# EAGLE design dummyLoad (EAGLE 7.5.0)
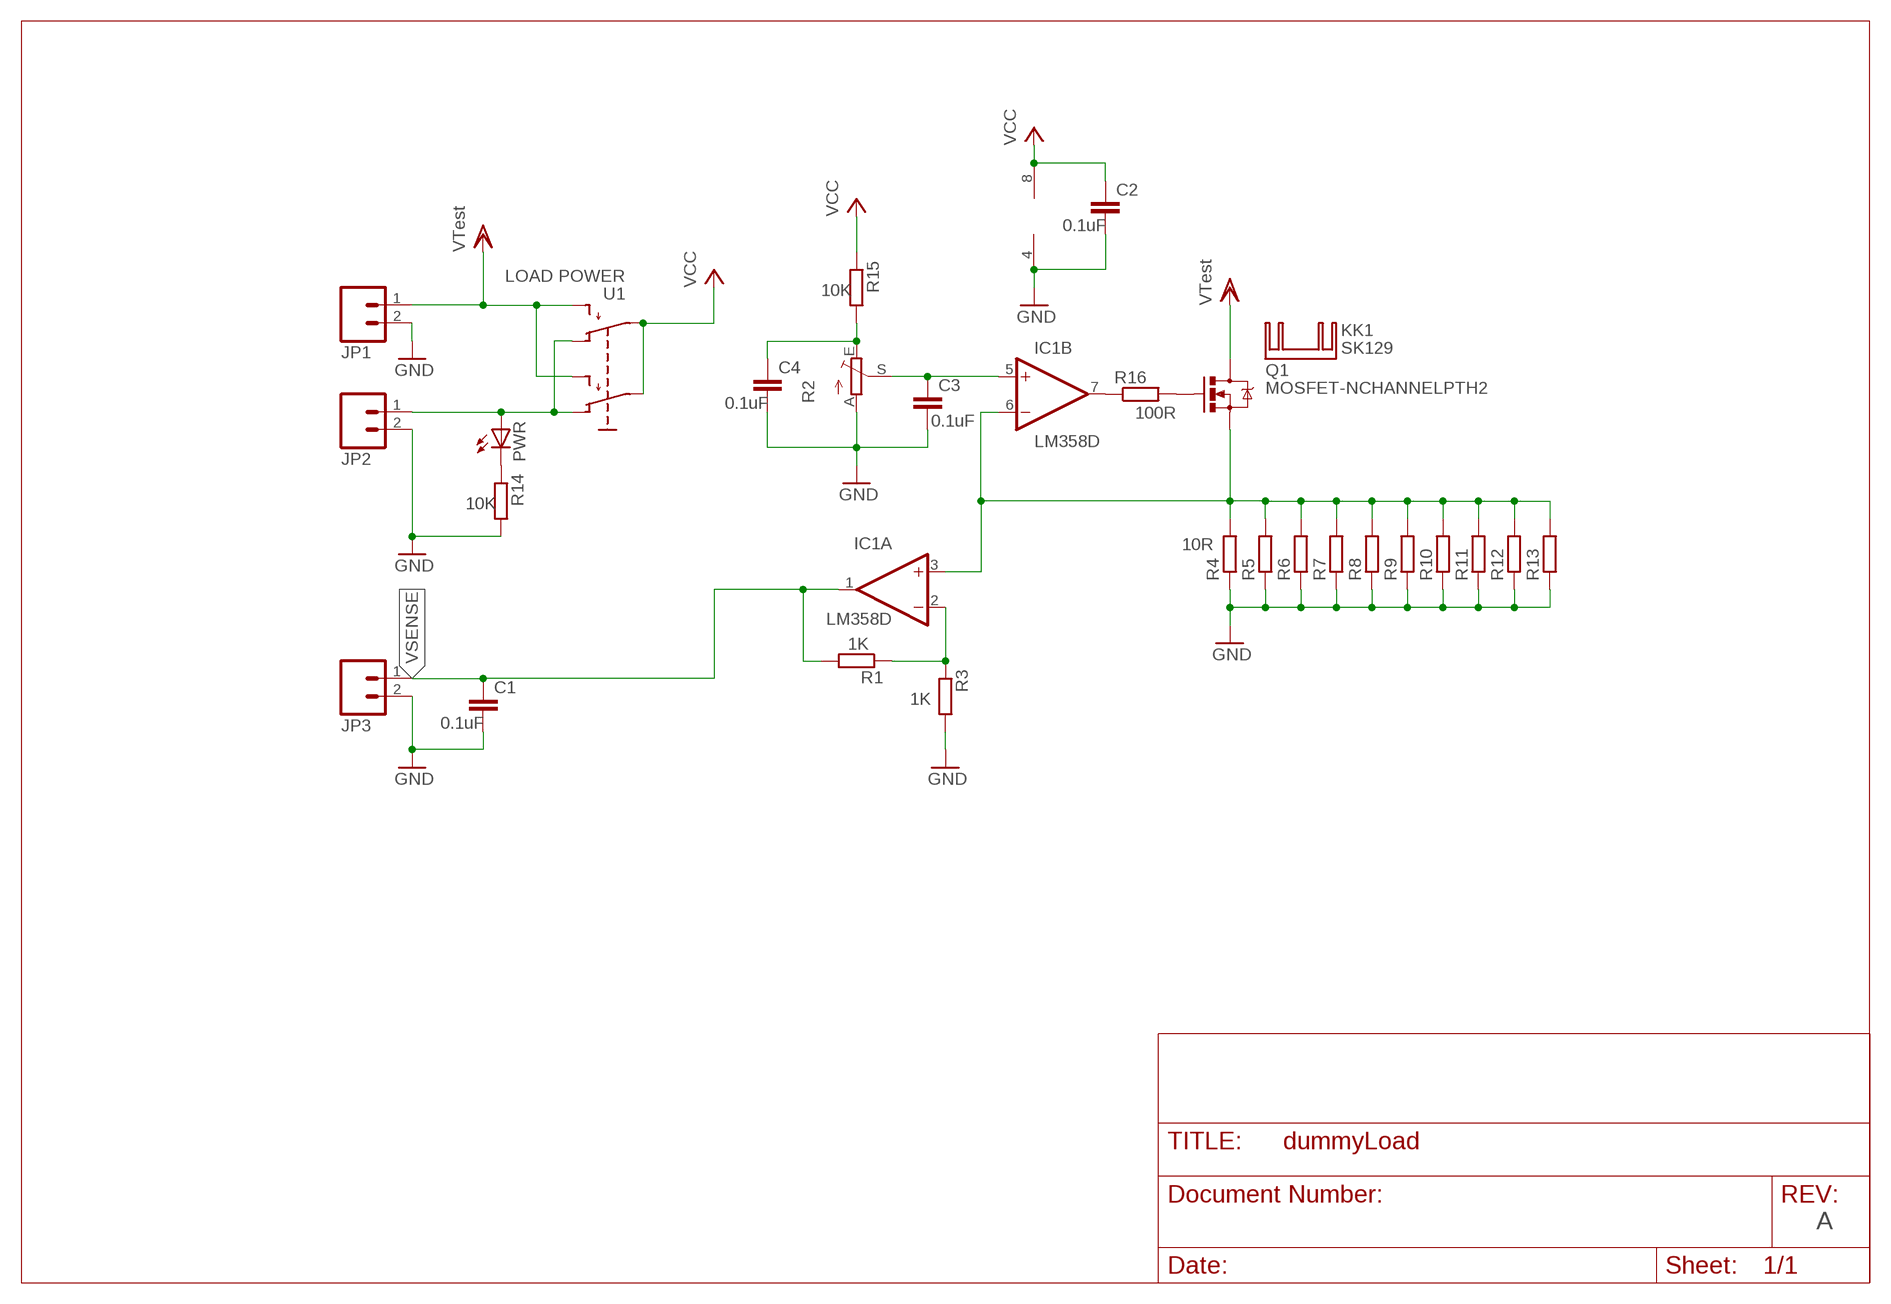
[diagram p0: schematic, sheet 1]

## Parts
C1  0.1uF  C-EUC0805  [C0805]
C2  0.1uF  C-EUC0805  [C0805]
C3  0.1uF  C-EUC0805  [C0805]
C4  0.1uF  C-EUC0805  [C0805]
IC1  LM358D  [SO08]
JP1  M02PTH  [1X02]
JP2  M02PTH  [1X02]
JP3  M02PTH  [1X02]
KK1  SK129  [SK129-HOLE]
PWR  LEDCHIPLED_0805  [CHIPLED_0805]
Q1  MOSFET-NCHANNELPTH2  [TO220V]
R1  1K  R-EU_M0805  [M0805]
R2  TRIM_EU-B64Y  [B64Y]
R3  1K  R-EU_M0805  [M0805]
R4  10R  R-EU_M0805  [M0805]
R5  R-EU_M0805  [M0805]
R6  R-EU_M0805  [M0805]
R7  R-EU_M0805  [M0805]
R8  R-EU_M0805  [M0805]
R9  R-EU_M0805  [M0805]
R10  R-EU_M0805  [M0805]
R11  R-EU_M0805  [M0805]
R12  R-EU_M0805  [M0805]
R13  R-EU_M0805  [M0805]
R14  10K  R-EU_M0805  [M0805]
R15  10K  R-EU_M0805  [M0805]
R16  100R  R-EU_M0805  [M0805]
U1  LOAD POWER  MINI_SWITCH  [SWITCH-JS202011]

## Nets
GND: C1.2 C2.2 C3.2 C4.2 IC1.4(P:V-) JP1.2 JP2.2 JP3.2 R2.A R3.2 R4.1 R5.1 R6.1 R7.1 R8.1 R9.1 R10.1 R11.1 R12.1 R13.1 R14.2
N$1: JP2.1 PWR.A U1.P1(O) U1.P4(O1)
N$2: IC1.2(A:-IN) R1.1 R3.1
N$3: C4.1 R2.E R15.2
N$4: IC1.7(B:OUT) R16.1
N$5: C3.1 IC1.5(B:+IN) R2.S
N$6: PWR.C R14.1
N$7: Q1.1(G) R16.2
N$19: IC1.3(A:+IN) IC1.6(B:-IN) Q1.3(S) R4.2 R5.2 R6.2 R7.2 R8.2 R9.2 R10.2 R11.2 R12.2 R13.2
VCC: C2.1 IC1.8(P:V+) R15.1 U1.P2(P) U1.P5(P1)
VDD: JP1.1 Q1.2(D) U1.P3(S) U1.P6(S1) ; supply symbol labelled VTest
VSENSE: C1.1 IC1.1(A:OUT) JP3.1 R1.2

## Notes on the sheet
- A

## Library data of the parts
C1-C4 = rcl:C-EU: CAPACITOR, European symbol
IC1 = linear:LM358: OP AMP also LM158; LM258; LM2904 Source: http://cache.national.com/ds/LM/LM158.pdf
JP1-JP3 = SparkFun:M02: Header 2 Standard 2-pin 0.1" header. Use with straight break away headers (SKU : PRT-00116), right angle break away headers (PRT-00553), swiss pins (PRT-00743), machine pins (PRT-00117), and female headers (PRT-00115). Molex polarized connector foot print use with SKU : PRT-08233 with associated crimp pins and housings.
KK1 = heatsink:SK129: HEATSINK manufacturer Fischer/distributor Buerklin
PWR = led:LED: LED OSRAM: - CHIPLED LG R971, LG N971, LY N971, LG Q971, LY Q971, LO R971, LY R971 LH N974, LH R974 LS Q976, LO Q976, LY Q976 LO Q996 - Hyper CHIPLED LW Q18S LB Q993, LB Q99A, LB R99A - SideLED LS A670, LO A670, LY A670, LG A670, LP A670 LB A673, LV A673, LT A673, LW A673 LH A674 LY A675 LS A676, LA A676, LO A676, LY A676, LW A676 LS A679, LY A679, LG A679 - Hyper Micro SIDELED® LS Y876, LA Y876, LO Y876, LY Y876 LT Y87S - SmartLED LW L88C, LW L88S LB L89C, LB L89S, LG L890 LS L89K, LO L89K, LY L89K LS L896, LA L896, LO L896, LY L896 - TOPLED LS T670, LO T670, LY T670, LG T670, LP T670 LSG T670, LSP T670, LSY T670, LOP T670, LYG T670 LG T671, LOG T671, LSG T671 LB T673, LV T673, LT T673, LW T673 LH T674 LS T676, LA T676, LO T676, LY T676, LB T676, LH T676, LSB T676, LW T676 LB T67C, LV T67C, LT T67C, LS T67K, LO T67K, LY T67K, LW E67C LS E67B, LA E67B, LO E67B, LY E67B, LB E67C, LV E67C, LT E67C LW T67C LS T679, LY T679, LG T679 LS T770, LO T770, LY T770, LG T770, LP T770 LB T773, LV T773, LT T773, LW T773 LH T774 LS E675, LA E675, LY E675, LS T675 LS T776, LA T776, LO T776, LY T776, LB T776 LHGB T686 LT T68C, LB T68C - Hyper Mini TOPLED® LB M676 - Mini TOPLED Santana® LG M470 LS M47K, LO M47K, LY M47K Source: http://www.osram.convergy.de LUXEON: - LUMILED® LXK2-PW12-R00, LXK2-PW12-S00, LXK2-PW14-U00, LXK2-PW14-V00 LXK2-PM12-R00, LXK2-PM12-S00, LXK2-PM14-U00 LXK2-PE12-Q00, LXK2-PE12-R00, LXK2-PE12-S00, LXK2-PE14-T00, LXK2-PE14-U00 LXK2-PB12-K00, LXK2-PB12-L00, LXK2-PB12-M00, LXK2-PB14-N00, LXK2-PB14-P00, LXK2-PB14-Q00 LXK2-PR12-L00, LXK2-PR12-M00, LXK2-PR14-Q00, LXK2-PR14-R00 LXK2-PD12-Q00, LXK2-PD12-R00, LXK2-PD12-S00 LXK2-PH12-R00, LXK2-PH12-S00 LXK2-PL12-P00, LXK2-PL12-Q00, LXK2-PL12-R00 Source: www.luxeon.com KINGBRIGHT: KA-3528ASYC Source: www.kingbright.com
Q1 = SparkFun:MOSFET-NCHANNEL
R1 R3-R16 = resistor:R-EU_: RESISTOR, European symbol
R2 = pot:TRIM_EU-: POTENTIOMETER
U1 = fmc:MINI_SWITCH

## Board
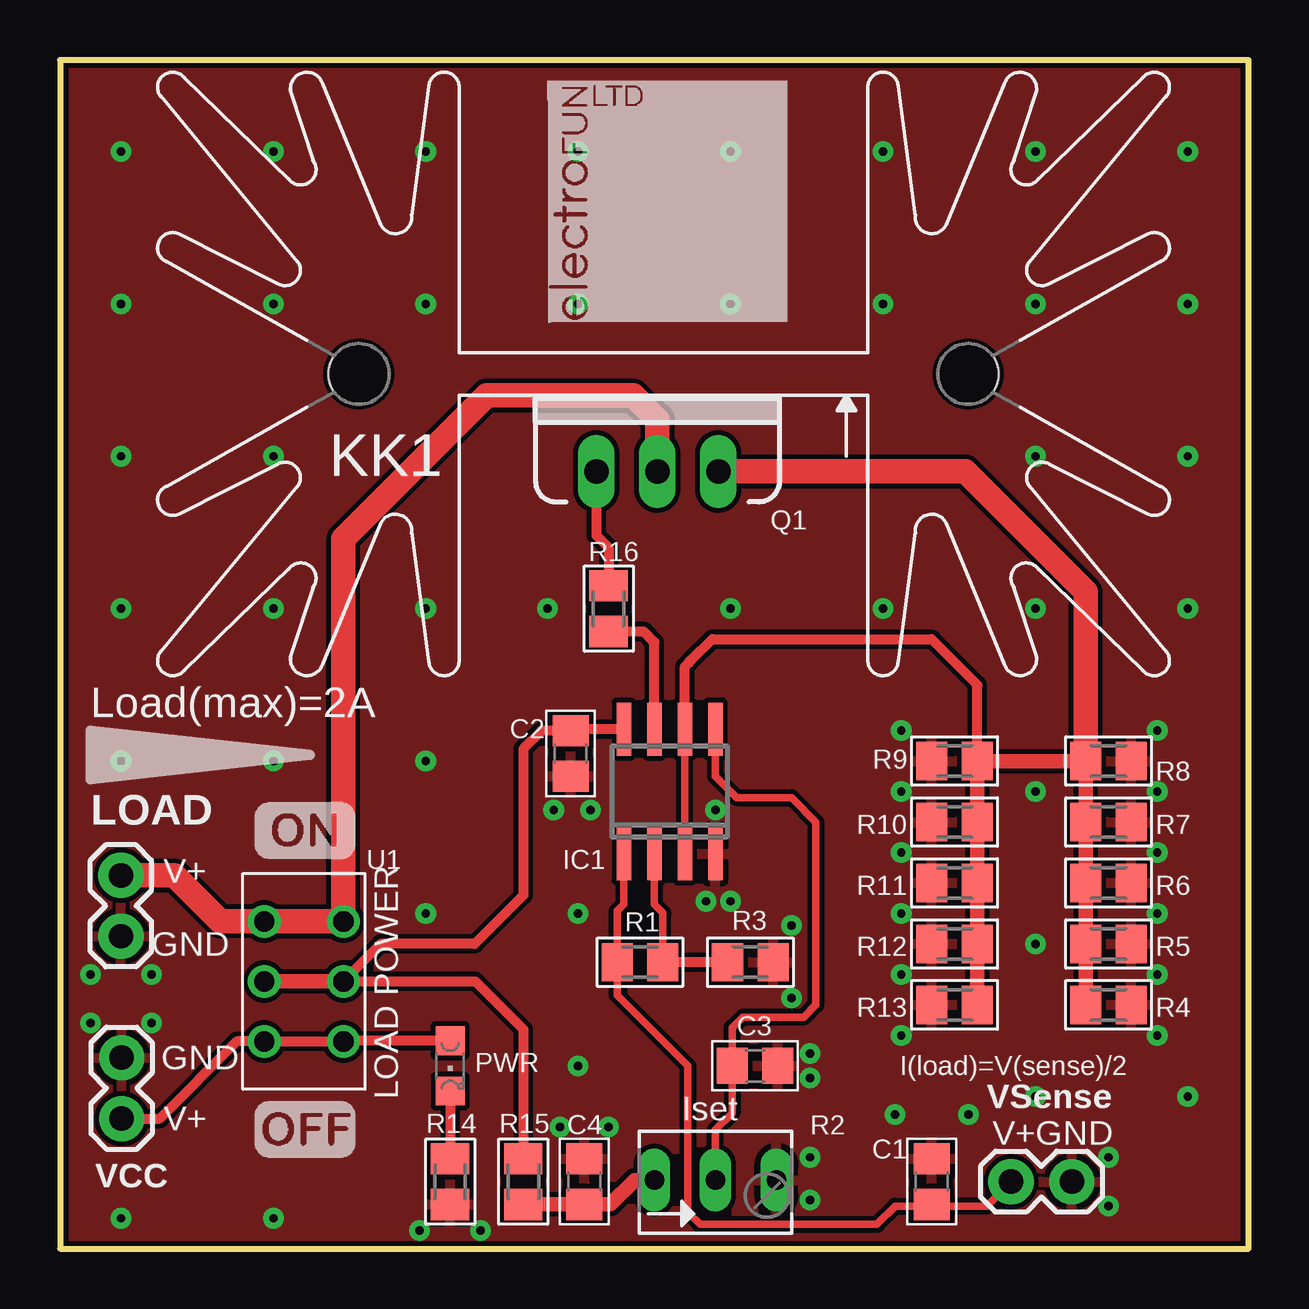
[diagram p1: board, top side]
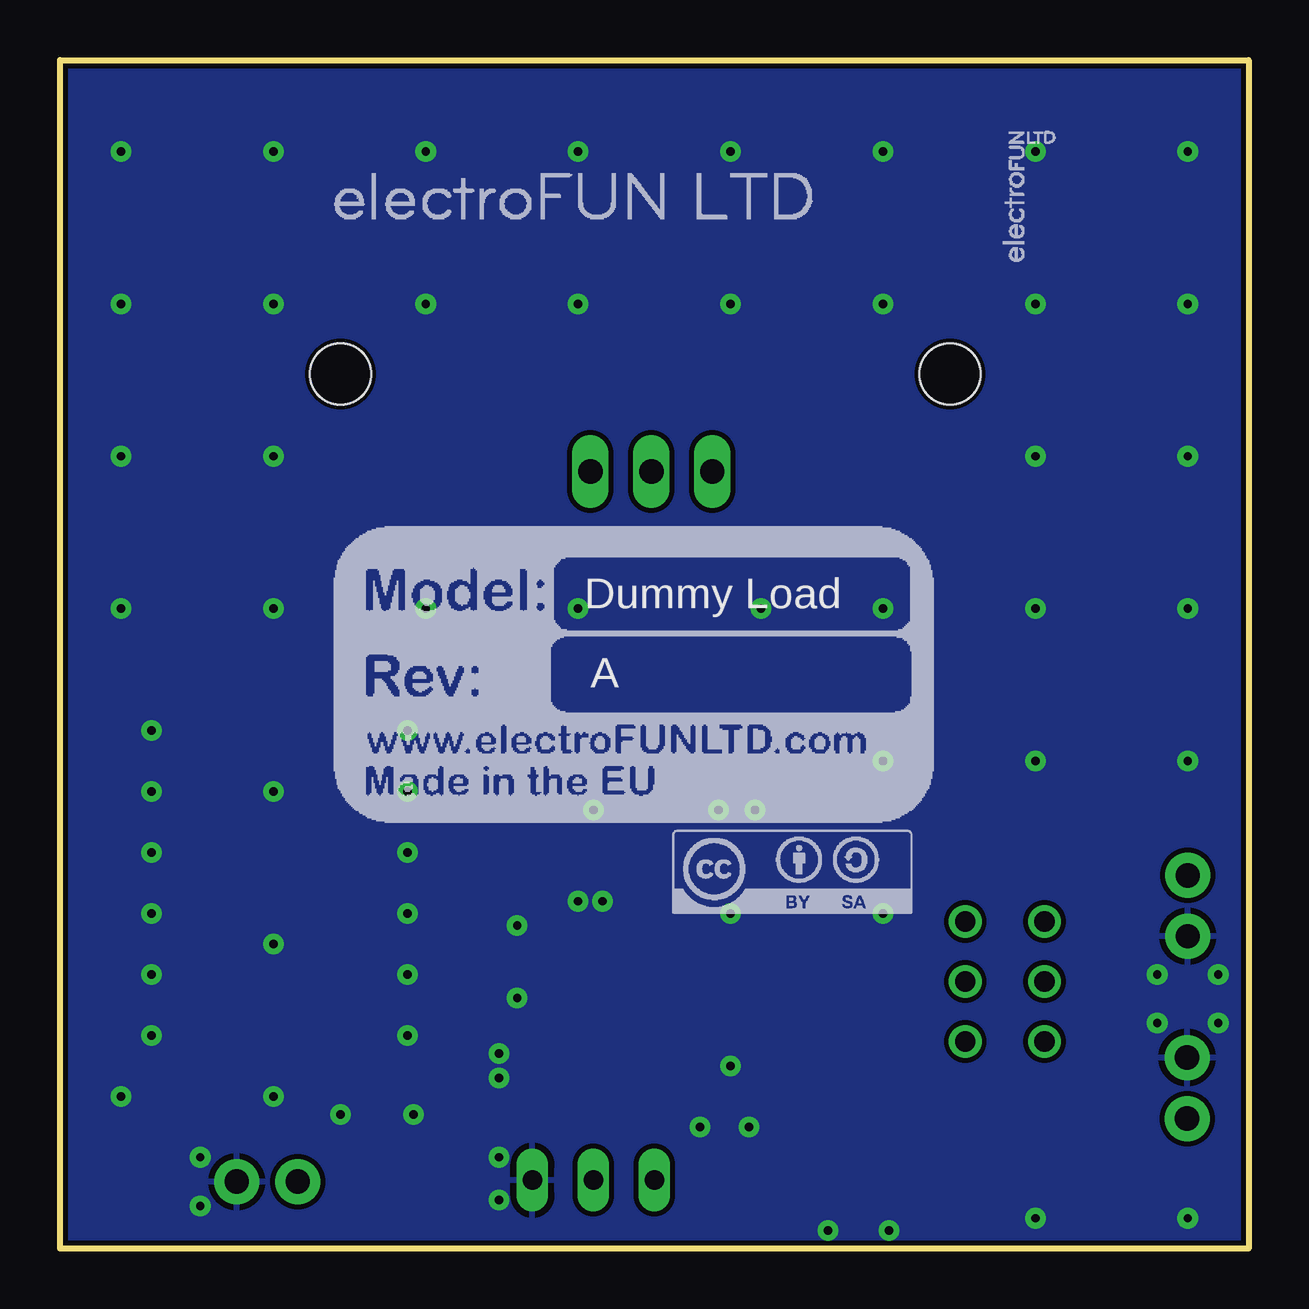
[diagram p2: board, bottom side, seen from below]

Size 49.53 x 49.53 mm. Coordinates in mm from the lower left corner, seen from the top.
Outline: 0,0 49.53,0 49.53,49.53 0,49.53 0,0
Copper layers (1*16): Top 0.035mm / dielectric 1.5mm / Bottom 0.035mm
Design rules "SparkFun-2-layer *": minimum track width 7mil, minimum drill 0.3mm, track to track 8mil, track to pad 8mil, pad to pad 8mil, via to via 8mil, smd to smd 8mil, copper to edge 8mil, drill to drill 8mil, minimum pad ring 10mil, minimum via ring 10mil, stop-mask expansion 4mil, vias tented up to drill 20mil, thermal gap 10mil

### Footprints (pad centres in the part's own frame; a part is rotated, then mirrored left to right if it is on the bottom)
C0805 = smd 1.3 x 1.5: 1 -0.95,0; 2 0.95,0
SO08 = smd 0.6 x 2.2: 1 -1.905,-2.6; 2 -0.635,-2.6; 3 0.635,-2.6; 4 1.905,-2.6; 5 1.905,2.6; 6 0.635,2.6; 7 -0.635,2.6; 8 -1.905,2.6
1X02 = drill 1.016 pad 1.88: 1 0,0; 2 2.54,0
SK129-HOLE = hole 2.54: -12.7,-0.889; 12.7,-0.889
CHIPLED_0805 = smd 1.2 x 1.2: A 0,-1.05; C 0,1.05
TO220V = drill 1.016 long: 1 -2.54,0; 2 0,0; 3 2.54,0
M0805 = smd 1.3 x 1.6: 1 -0.95,0; 2 0.95,0
B64Y = drill 0.813 long: A 2.54,0; E -2.54,0; S 0,0
SWITCH-JS202011 = drill 0.85: P1 0,-1.65; P2 2.5,-1.65; P3 5,-1.65; P4 0,1.65; P5 2.5,1.65; P6 5,1.65

### Placement (x,y rotation side)
C1  36.32,2.79 90 top
C2  21.27,20.64 270 top
C3  28.96,7.62 0 top
C4  21.84,2.79 90 top
IC1  25.4,19.05 0 top
JP1  2.54,15.56 270 top
JP2  2.57,5.42 90 top
JP3  39.62,2.79 0 top
KK1  25.15,35.56 180 top
PWR  16.26,7.62 180 top
Q1  24.89,32.38 0 top
R1  24.17,11.94 180 top
R2  27.3,2.86 0 top
R3  28.77,11.94 0 top
R4  43.69,10.16 180 top
R5  43.69,12.7 180 top
R6  43.69,15.24 180 top
R7  43.69,17.78 180 top
R8  43.69,20.32 180 top
R9  37.27,20.32 0 top
R10  37.27,17.78 0 top
R11  37.27,15.24 0 top
R12  37.27,12.7 0 top
R13  37.27,10.16 0 top
R14  16.26,2.79 270 top
R15  19.3,2.79 270 top
R16  22.86,26.67 90 top
U1  10.16,8.64 90 top
U$1  [ELECTROFUN_10X10]  20.32,38.61 0 top
U$2  [ON]  8.13,16.26 0 top
U$3  [ELECTROFUN_STRIP]  43.5,40.64 0 bottom
U$4  [SA-BY]  24,13.97 0 bottom
U$5  [OFF]  8.13,3.81 0 top
U$6  [BOARD_REF]  38.1,17.78 0 bottom

### Tracks (layer width: path | path; a pad name or v marks a point on that pad's centre or on a via)
GND  (via drill 0.35)
  other vias: 22.1,18.29 20.57,18.29 26.92,14.48 27.94,14.48 30.48,13.46 30.48,10.44 31.24,8.13 31.24,7.11 22.86,5.08 20.83,5.08 35.05,21.59 35.05,19.05 35.05,16.51 35.05,13.97 35.05,11.43 35.05,8.89 45.72,21.59 45.72,19.05 45.72,16.51 45.72,13.97 45.72,11.43 45.72,8.89 37.85,5.59 34.8,5.59 43.69,3.81 43.69,1.78 31.24,2.03 31.24,3.81 27.3,18.29 2.54,45.72 8.89,45.72 8.89,39.37 2.54,39.37 2.54,33.02 8.89,33.02 2.54,26.67 8.89,26.67 8.89,20.32 2.54,20.32 1.27,11.43 3.81,11.43 1.27,9.4 3.81,9.4 15.24,45.72 15.24,39.37 21.59,45.72 21.59,39.37 27.94,39.37 27.94,45.72 34.29,39.37 34.29,45.72 40.64,45.72 40.64,39.37 46.99,39.37 46.99,45.72 46.99,33.02 40.64,33.02 40.64,26.67 34.29,26.67 27.94,26.67 46.99,26.67 40.64,19.05 40.64,12.7 40.64,6.35 46.99,6.35 15.24,20.32 15.24,26.67 20.32,26.67 15.24,13.97 21.59,13.97 21.59,7.62 8.89,1.27 2.54,1.27 14.99,0.76 17.53,0.76
  pour Top (rank 3): 0,0 0,49.53 49.53,49.53 49.53,0
  pour Bottom: 49.85,49.85 49.85,0.32 6.35,0 0,0 0,49.85
N$1
  Top 0.406: U1.P1 U1.P4 7.37,8.64 4.15,5.42 JP2.1 | PWR.A 11.84,8.67
  Top 0.61: 11.84,8.67 U1.P1
N$2
  Top 0.305: IC1.2 24.77,14.35 25.12,14 R1.1
  Top 0.406: R3.1 R1.1
N$3
  Top 0.61: R15.2 C4.1 22.93,1.84 23.94,2.86 R2.E
N$4
  Top 0.406: R16.1 24.32,25.72 24.77,25.27 IC1.7
N$5
  Top 0.305: R2.S 27.3,4.95 28.01,5.65 C3.1 28.01,9.21 28.45,9.65 30.99,9.65 31.5,10.16 31.5,17.78 30.48,18.8 28.19,18.8 27.3,19.68 IC1.5
N$6
  Top 0.406: PWR.C R14.1
N$7
  Top 0.406: Q1.1 22.35,29.72 22.86,29.21 R16.2
N$19
  Top 0.305: IC1.3 IC1.6
  Top 0.406: R9.2 38.22,23.5 36.32,25.4 27.18,25.4 26.29,24.51 26.16,24.38 26.04,24.26 IC1.6
  Top 0.61: R4.2 R5.2 R6.2 R7.2 R8.2 R9.2 R10.2 R11.2 R12.2 R13.2
  Top 1.016: Q1.3 37.72,32.38 42.74,27.37 R8.2
VCC
  Top 0.406: R15.1 19.3,9.14 17.31,11.14 U1.P2 13.37,12.7 17.27,12.7 19.3,14.73 19.3,20.83 20.07,21.59 C2.1 21.34,21.65 IC1.8
  Top 0.61: U1.P5 U1.P2
VDD
  Top 1.016: JP1.1 4.76,15.56 6.68,13.64 U1.P6 U1.P3 11.81,29.59 17.78,35.56 23.88,35.56 24.89,34.54 Q1.2
VSENSE
  Top 0.305: IC1.1 23.5,14.35 23.22,14.07 R1.2 23.22,10.56 26.16,7.62 26.16,1.52 26.67,1.02 34.04,1.02 34.8,1.78 36.26,1.78 C1.1 36.39,1.78 38.61,1.78 JP3.1

### Text on the board
tPlace: Load(max)=2A | LOAD | V+ | GND | GND | I(load)=V(sense)/2 | VSense | V+ | Iset | V+ | GND | VCC
bPlace: Dummy Load | A